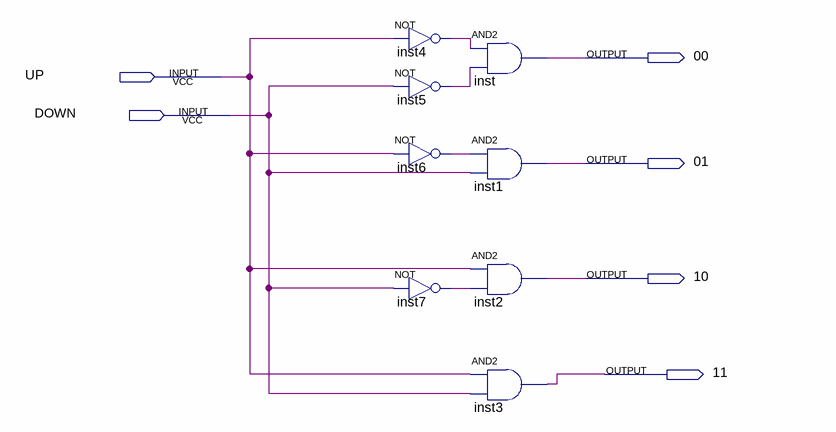
[diagram p0: schematic sheet]
// Quartus schematic MUX.bdf as structural Verilog: 8 symbols, 6 pins
module MUX (
  input  UP,
  input  DOWN,
  output \00 ,
  output \01 ,
  output \10 ,
  output \11 
);

  wire inst4_out, inst5_out, inst6_out, inst7_out;

  not inst4 (inst4_out, UP);
  not inst5 (inst5_out, DOWN);
  not inst6 (inst6_out, UP);
  not inst7 (inst7_out, DOWN);
  and inst (\00 , inst4_out, inst5_out);
  and inst1 (\01 , inst6_out, DOWN);
  and inst2 (\10 , UP, inst7_out);
  and inst3 (\11 , UP, DOWN);
endmodule
